# EAGLE board reg-board (EAGLE 7.6.0)
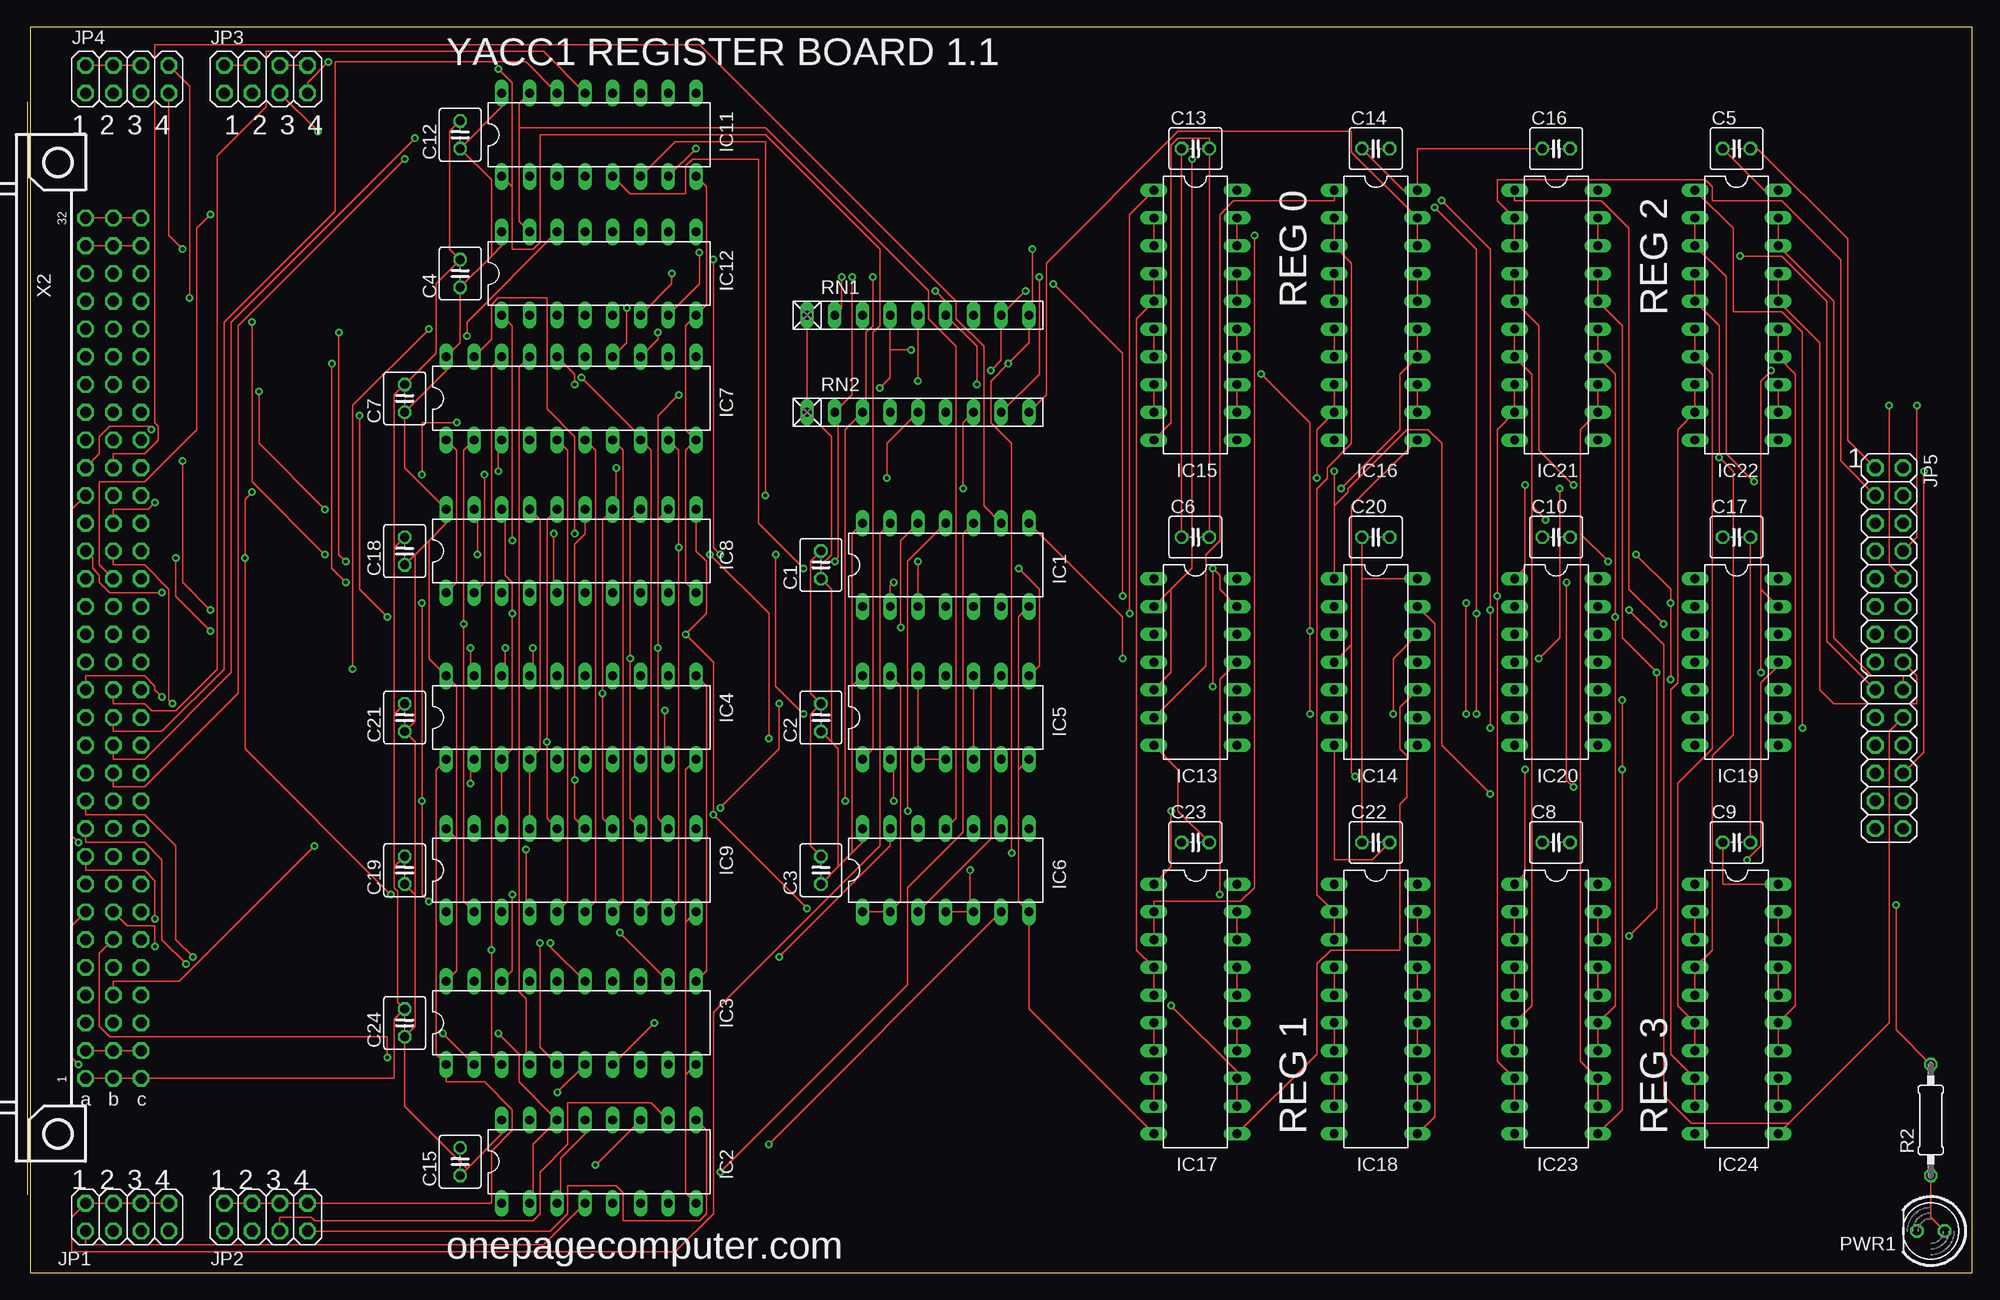
[diagram p3: board, top side]
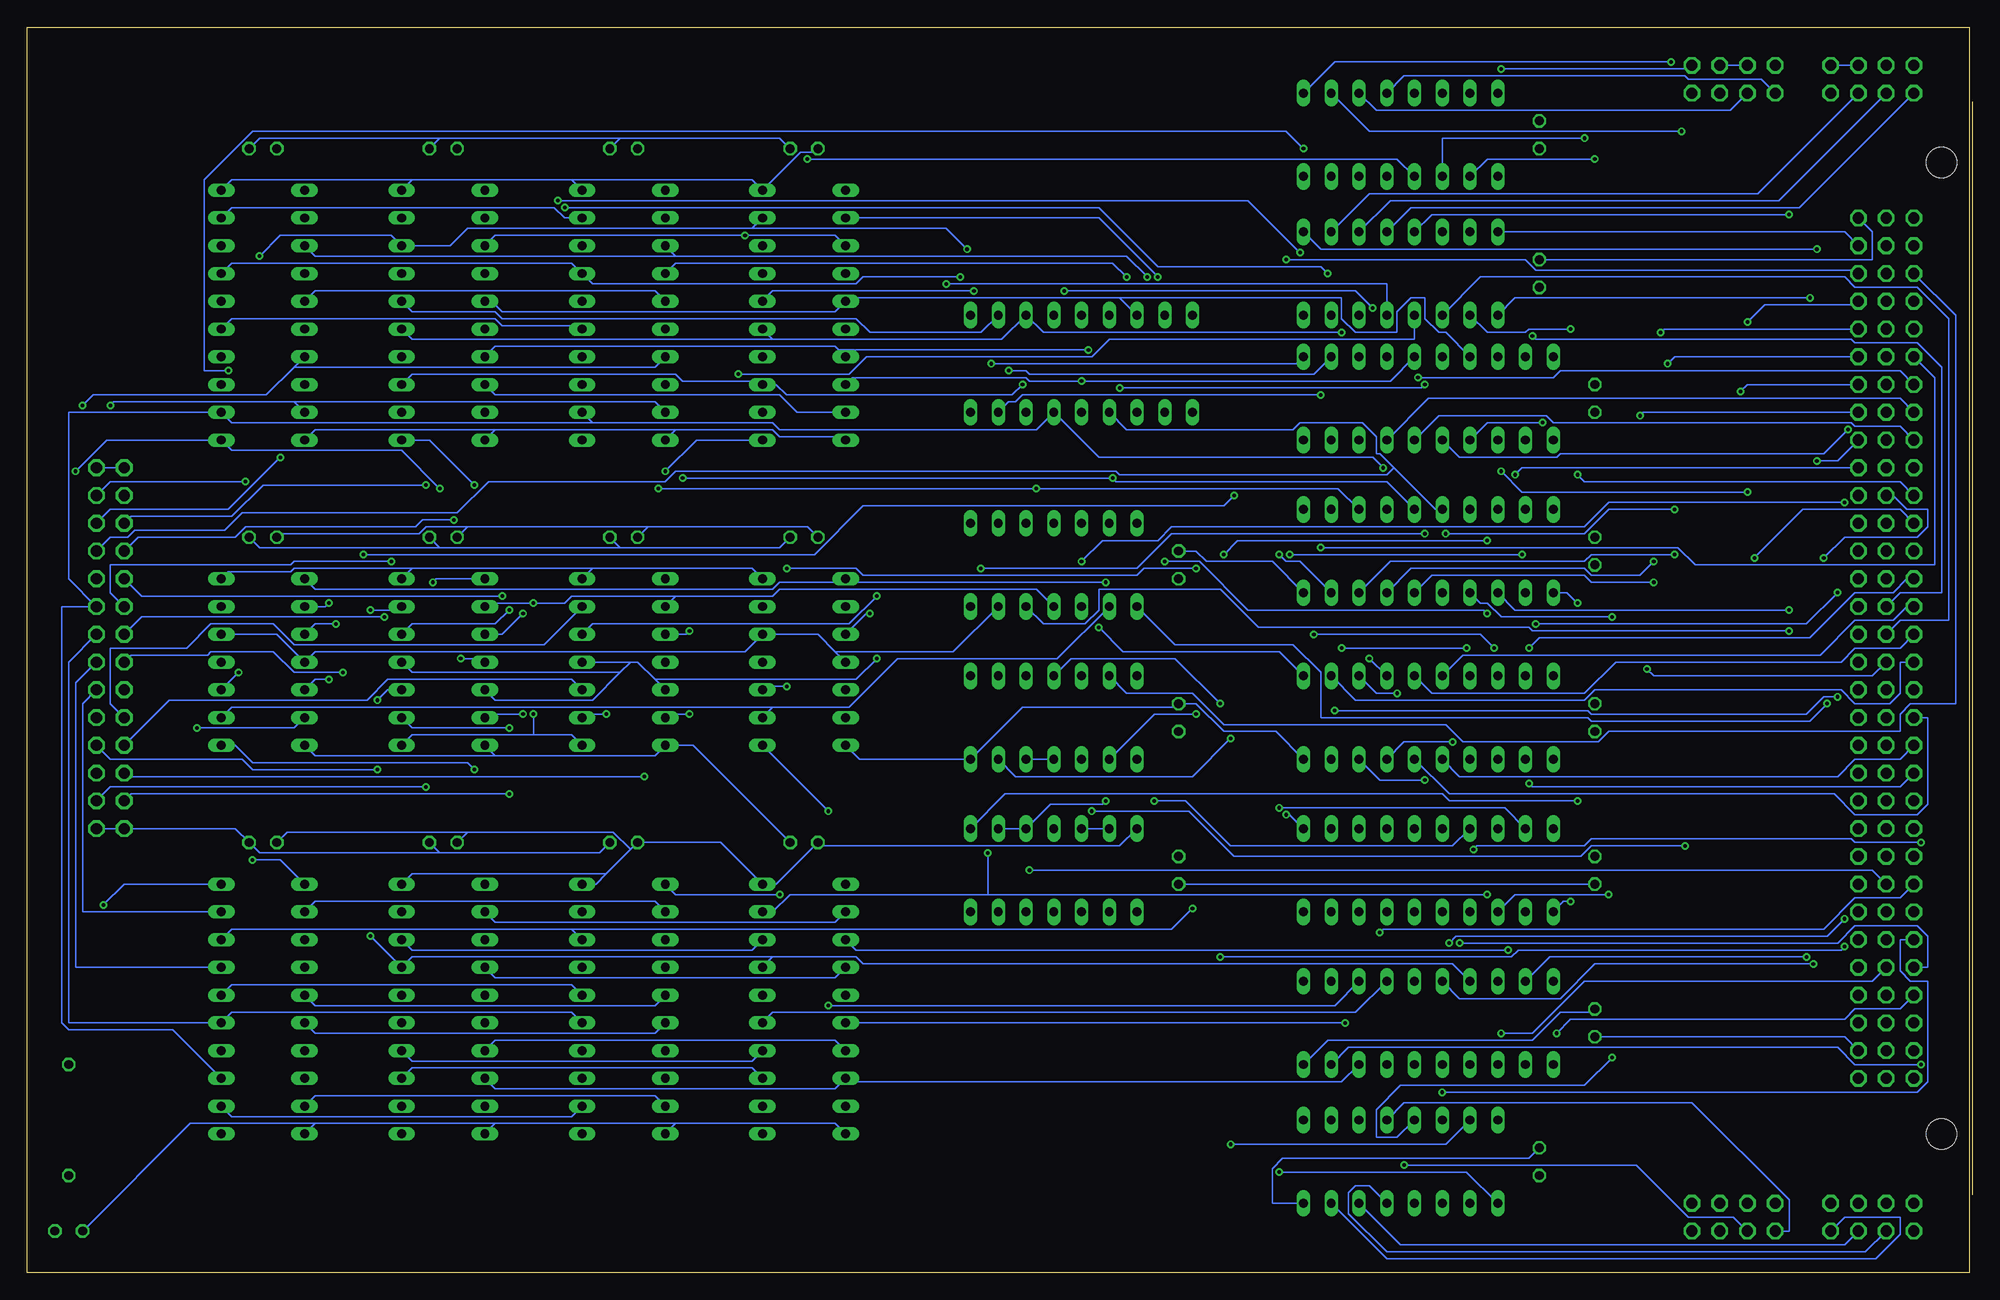
[diagram p4: board, bottom side, seen from below]

Size 177.78 x 113.97 mm. Coordinates in mm from the lower left corner, seen from the top.
Outline: 0,0 177.78,0 177.78,113.97 0,113.97 0,0
Copper layers (1*16): Top 0.0356mm / dielectric 1.5011mm / Bottom 0.0356mm
Design rules "LaenPCBOrder *": minimum track width 6mil, minimum drill 13mil, track to track 8mil, track to pad 8mil, pad to pad 8mil, via to via 8mil, smd to smd 6mil, copper to edge 20mil, drill to drill 6mil, minimum pad ring 7mil, minimum via ring 7mil, stop-mask expansion 3mil, vias tented up to drill 0mil, thermal gap 10mil
Net classes: 1 GND: width 1 mm; 2 5V: width 1 mm

## Footprints (pad centres in the part's own frame; a part is rotated, then mirrored left to right if it is on the bottom)
C025-040X050 = drill 0.813 octagon: 1 -1.27,0; 2 1.27,0
DIL14 = drill 0.813 long: 1 -7.62,-3.81; 2 -5.08,-3.81; 3 -2.54,-3.81; 4 0,-3.81; 5 2.54,-3.81; 6 5.08,-3.81; 7 7.62,-3.81; 8 7.62,3.81; 9 5.08,3.81; 10 2.54,3.81; 11 0,3.81; 12 -2.54,3.81; 13 -5.08,3.81; 14 -7.62,3.81
DIL16 = drill 0.813 long: 1 -8.89,-3.81; 2 -6.35,-3.81; 3 -3.81,-3.81; 4 -1.27,-3.81; 5 1.27,-3.81; 6 3.81,-3.81; 7 6.35,-3.81; 8 8.89,-3.81; 9 8.89,3.81; 10 6.35,3.81; 11 3.81,3.81; 12 1.27,3.81; 13 -1.27,3.81; 14 -3.81,3.81; 15 -6.35,3.81; 16 -8.89,3.81
DIL20 = drill 0.813 long: 1 -11.43,-3.81; 2 -8.89,-3.81; 3 -6.35,-3.81; 4 -3.81,-3.81; 5 -1.27,-3.81; 6 1.27,-3.81; 7 3.81,-3.81; 8 6.35,-3.81; 9 8.89,-3.81; 10 11.43,-3.81; 11 11.43,3.81; 12 8.89,3.81; 13 6.35,3.81; 14 3.81,3.81; 15 1.27,3.81; 16 -1.27,3.81; 17 -3.81,3.81; 18 -6.35,3.81; 19 -8.89,3.81; 20 -11.43,3.81
2X04 = drill 1.016 octagon: 1 -3.81,-1.27; 2 -3.81,1.27; 3 -1.27,-1.27; 4 -1.27,1.27; 5 1.27,-1.27; 6 1.27,1.27; 7 3.81,-1.27; 8 3.81,1.27
2X14 = drill 1.016 octagon: 1 -16.51,-1.27; 2 -16.51,1.27; 3 -13.97,-1.27; 4 -13.97,1.27; 5 -11.43,-1.27; 6 -11.43,1.27; 7 -8.89,-1.27; 8 -8.89,1.27; 9 -6.35,-1.27; 10 -6.35,1.27; 11 -3.81,-1.27; 12 -3.81,1.27; 13 -1.27,-1.27; 14 -1.27,1.27; 15 1.27,-1.27; 16 1.27,1.27; 17 3.81,-1.27; 18 3.81,1.27; 19 6.35,-1.27; 20 6.35,1.27; 21 8.89,-1.27; 22 8.89,1.27; 23 11.43,-1.27; 24 11.43,1.27; 25 13.97,-1.27; 26 13.97,1.27; 27 16.51,-1.27; 28 16.51,1.27
LED5MM = drill 0.813 octagon: A -1.27,0; K 1.27,0
0207/10 = drill 0.813 octagon: 1 -5.08,0; 2 5.08,0
RN-9 = drill 0.813 long: 1 -10.16,0; 2 -7.62,0; 3 -5.08,0; 4 -2.54,0; 5 0,0; 6 2.54,0; 7 5.08,0; 8 7.62,0; 9 10.16,0
FABC96R = drill 1.016 octagon: A1 -2.54,39.37; A2 -2.54,36.83; A3 -2.54,34.29; A4 -2.54,31.75; A5 -2.54,29.21; A6 -2.54,26.67; A7 -2.54,24.13; A8 -2.54,21.59; A9 -2.54,19.05; A10 -2.54,16.51; A11 -2.54,13.97; A12 -2.54,11.43; A13 -2.54,8.89; A14 -2.54,6.35; A15 -2.54,3.81; A16 -2.54,1.27; A17 -2.54,-1.27; A18 -2.54,-3.81; A19 -2.54,-6.35; A20 -2.54,-8.89; A21 -2.54,-11.43; A22 -2.54,-13.97; A23 -2.54,-16.51; A24 -2.54,-19.05; A25 -2.54,-21.59; A26 -2.54,-24.13; A27 -2.54,-26.67; A28 -2.54,-29.21; A29 -2.54,-31.75; A30 -2.54,-34.29; A31 -2.54,-36.83; A32 -2.54,-39.37; B1 -5.08,39.37; B2 -5.08,36.83; B3 -5.08,34.29; B4 -5.08,31.75; B5 -5.08,29.21; B6 -5.08,26.67; B7 -5.08,24.13; B8 -5.08,21.59; B9 -5.08,19.05; B10 -5.08,16.51; B11 -5.08,13.97; B12 -5.08,11.43; B13 -5.08,8.89; B14 -5.08,6.35; B15 -5.08,3.81; B16 -5.08,1.27; B17 -5.08,-1.27; B18 -5.08,-3.81; B19 -5.08,-6.35; B20 -5.08,-8.89; B21 -5.08,-11.43; B22 -5.08,-13.97; B23 -5.08,-16.51; B24 -5.08,-19.05; B25 -5.08,-21.59; B26 -5.08,-24.13; B27 -5.08,-26.67; B28 -5.08,-29.21; B29 -5.08,-31.75; B30 -5.08,-34.29; B31 -5.08,-36.83; B32 -5.08,-39.37; C1 -7.62,39.37; C2 -7.62,36.83; C3 -7.62,34.29; C4 -7.62,31.75; C5 -7.62,29.21; C6 -7.62,26.67; C7 -7.62,24.13; C8 -7.62,21.59; C9 -7.62,19.05; C10 -7.62,16.51; C11 -7.62,13.97; C12 -7.62,11.43; C13 -7.62,8.89; C14 -7.62,6.35; C15 -7.62,3.81; C16 -7.62,1.27; C17 -7.62,-1.27; C18 -7.62,-3.81; C19 -7.62,-6.35; C20 -7.62,-8.89; C21 -7.62,-11.43; C22 -7.62,-13.97; C23 -7.62,-16.51; C24 -7.62,-19.05; C25 -7.62,-21.59; C26 -7.62,-24.13; C27 -7.62,-26.67; C28 -7.62,-29.21; C29 -7.62,-31.75; C30 -7.62,-34.29; C31 -7.62,-36.83; C32 -7.62,-39.37 | hole 2.794: 0,-44.456; 0,44.456

## Placement (x,y rotation side)
C1  [C025-040X050]  72.39,64.77 90 top
C2  [C025-040X050]  72.39,50.8 90 top
C3  [C025-040X050]  72.39,36.83 90 top
C4  [C025-040X050]  39.37,91.44 90 top
C5  [C025-040X050]  156.21,102.87 0 top
C6  [C025-040X050]  106.68,67.31 0 top
C7  [C025-040X050]  34.29,80.01 90 top
C8  [C025-040X050]  139.7,39.37 0 top
C9  [C025-040X050]  156.21,39.37 0 top
C10  [C025-040X050]  139.7,67.31 0 top
C12  [C025-040X050]  39.37,104.14 90 top
C13  [C025-040X050]  106.68,102.87 0 top
C14  [C025-040X050]  123.19,102.87 0 top
C15  [C025-040X050]  39.37,10.16 90 top
C16  [C025-040X050]  139.7,102.87 0 top
C17  [C025-040X050]  156.21,67.31 0 top
C18  [C025-040X050]  34.29,66.04 90 top
C19  [C025-040X050]  34.29,36.83 90 top
C20  [C025-040X050]  123.19,67.31 0 top
C21  [C025-040X050]  34.29,50.8 90 top
C22  [C025-040X050]  123.19,39.37 0 top
C23  [C025-040X050]  106.68,39.37 0 top
C24  [C025-040X050]  34.29,22.86 90 top
IC1  74LS04N  [DIL14]  83.82,64.77 0 top
IC2  74LS139N  [DIL16]  52.07,10.16 0 top
IC3  74S374N  [DIL20]  49.53,22.86 0 top
IC4  74S374N  [DIL20]  49.53,50.8 0 top
IC5  74LS00N  [DIL14]  83.82,50.8 0 top
IC6  74LS00N  [DIL14]  83.82,36.83 0 top
IC7  74LS245N  [DIL20]  49.53,80.01 0 top
IC8  74LS245N  [DIL20]  49.53,66.04 0 top
IC9  74LS245N  [DIL20]  49.53,36.83 0 top
IC11  74LS139N  [DIL16]  52.07,104.14 0 top
IC12  74LS139N  [DIL16]  52.07,91.44 0 top
IC13  7432N  [DIL14]  106.68,55.88 270 top
IC14  74LS02N  [DIL14]  123.19,55.88 270 top
IC15  74S374N  [DIL20]  106.68,87.63 270 top
IC16  74S374N  [DIL20]  123.19,87.63 270 top
IC17  74S374N  [DIL20]  106.68,24.13 270 top
IC18  74S374N  [DIL20]  123.19,24.13 270 top
IC19  7432N  [DIL14]  156.21,55.88 270 top
IC20  74LS02N  [DIL14]  139.7,55.88 270 top
IC21  74S374N  [DIL20]  139.7,87.63 270 top
IC22  74S374N  [DIL20]  156.21,87.63 270 top
IC23  74S374N  [DIL20]  139.7,24.13 270 top
IC24  74S374N  [DIL20]  156.21,24.13 270 top
JP1  [2X04]  8.89,5.08 0 top
JP2  [2X04]  21.59,5.08 0 top
JP3  [2X04]  21.59,109.22 0 top
JP4  [2X04]  8.89,109.22 0 top
JP5  [2X14]  170.18,57.15 270 top
PWR1  [LED5MM]  173.99,3.81 180 top
R2  330  [0207/10]  173.99,13.97 90 top
RN1  [RN-9]  81.28,87.63 0 top
RN2  [RN-9]  81.28,78.74 0 top
X2  FABC96R  [FABC96R]  2.54,57.15 180 top

## Tracks (layer width: path | path; a pad name or v marks a point on that pad's centre or on a via)
-R0-RDSEL  (via drill 0.33)
  Top 0.152: v106.36,101.92 106.36,64.45 104.46,62.55 | IC13.2 104.46,62.55 | IC13.5 104.46,54.93 104.46,62.55
  Bottom 0.152: IC11.4 52.39,101.92 v106.36,101.92
-R0-WRSEL  (via drill 0.33)
  Top 0.152: v112.71,82.23 117.16,77.79 v117.16,58.74 v117.16,51.12
  Bottom 0.152: IC12.4 50.8,85.41 78.74,85.41 80.33,83.82 100.97,83.82 102.55,82.23 v112.71,82.23 | v117.16,58.74 117.47,58.42 IC14.3 | IC14.6 119.06,51.12 v117.16,51.12
-R1-RDSEL  (via drill 0.33)
  Top 0.152: IC11.5 54.93,98.74 60.01,98.74 60.01,101.28 60.64,101.92 66.67,101.92 66.67,68.58 v70.8,64.45 | IC13.13 108.9,62.55 108.9,63.82 v108.27,64.45 v108.27,53.66
  Bottom 0.152: v70.8,64.45 75.56,64.45 76.2,63.82 101.28,63.82 101.92,64.45 v108.27,64.45 | IC13.10 110.17,53.66 v108.27,53.66
-R1-WRSEL  (via drill 0.33)
  Top 0.152: v93.66,90.49 100.01,84.14 v100.01,61.91 | v124.78,51.12 124.78,56.2 IC14.12
  Bottom 0.152: IC12.5 53.34,90.49 v93.66,90.49 | v100.01,61.91 102.55,59.37 126.05,59.37 IC14.12 | IC14.9 126.68,51.12 v124.78,51.12
-R2-RDSEL  (via drill 0.33)
  Top 0.152: IC11.6 59.05,103.5 67.31,103.5 v67.31,71.12 | v147,65.72 150.18,62.55 v150.18,61.28 v150.18,54.29
  Bottom 0.152: v67.31,71.12 68.26,70.17 101.28,70.17 105.73,65.72 v147,65.72 | v150.18,61.28 150.5,60.96 IC19.2 | IC19.5 151.45,54.29 v150.18,54.29
-R2-WRSEL  (via drill 0.33)
  Top 0.152: IC12.6 58.74,90.49 v58.74,91.44 | v128.59,97.47 132.4,93.66 v132.4,60.33 v132.4,51.12
  Bottom 0.152: v58.74,91.44 59.37,92.08 74.3,92.08 79.69,97.47 v128.59,97.47 | v132.4,60.33 134.3,58.42 IC20.3 | IC20.6 135.57,51.12 v132.4,51.12
-R3-RDSEL  (via drill 0.33)
  Top 0.152: v60.96,102.87 IC11.7 | v159.38,82.55 158.43,81.6 158.43,62.55 | IC19.13 158.43,62.55 | 158.43,62.55 v158.43,54.93
  Bottom 0.152: v60.96,102.87 62.55,104.46 157.16,104.46 161.61,100.01 161.61,82.55 v159.38,82.55 | v158.43,54.93 IC19.10
-R3-WRSEL  (via drill 0.33)
  Top 0.152: IC12.7 61.28,90.49 v61.28,93.34 | v129.22,98.11 133.67,93.66 v133.67,60.64 v133.67,49.85
  Bottom 0.152: v61.28,93.34 66.04,98.11 v129.22,98.11 | v133.67,60.64 134.94,59.37 142.56,59.37 IC20.12 | IC20.9 142.56,49.85 v133.67,49.85
-RDSEL  (via drill 0.33)
  Top 0.152: JP3.4 JP3.2 | JP3.8 JP3.6 | IC5.1 77.15,47.94 77.15,86.04 77.79,86.68 77.79,93.66 67.31,104.14 46.67,104.14 46.67,94.3 46.04,93.66 44.13,93.66 44.13,99.38 | IC11.1 44.13,99.38 | v42.86,110.17 44.13,108.9 44.13,99.38
  Bottom 0.152: JP3.6 JP3.4 | JP3.8 25.72,110.17 v42.86,110.17
-RFUNC
  Top 0.152: IC12.15 44.77,96.2 44.77,104.78 | 44.77,104.78 44.77,107 IC11.15 | IC6.11 84.77,41.59 84.77,84.77 82.23,87.31 82.23,89.85 67.31,104.78 44.77,104.78
-RRDH
  Bottom 0.152: IC19.12 154.94,58.42 IC19.4 151.45,56.83 112.08,56.83 IC13.12 105.41,58.42 103.82,56.83 | 103.82,56.83 IC13.4 | IC1.6 93.03,56.83 103.82,56.83
-RRDL  (via drill 0.33)
  Top 0.152: v79.06,63.18 78.74,62.87 IC1.2
  Bottom 0.152: IC19.1 151.45,62.55 109.54,62.55 108.9,63.18 103.19,63.18 IC13.1 102.55,63.18 v79.06,63.18 | IC1.2 83.5,56.2 98.11,56.2 102.55,51.75 109.54,51.75 | IC13.9 109.54,51.75 | IC19.9 159.07,51.75 109.54,51.75
-RWRH  (via drill 0.33)
  Top 0.152: IC1.8 100.01,60.01 v100.01,56.2
  Bottom 0.152: 120.33,54.29 121.92,55.88 122.56,55.88 | 120.33,54.29 IC14.5 | IC14.11 122.56,55.88 | v100.01,56.2 101.92,54.29 120.33,54.29 | IC20.5 134.94,52.39 126.05,52.39 123.51,54.93 | 122.56,55.88 123.51,54.93 | IC20.11 142.56,54.93 123.51,54.93
-RWRL  (via drill 0.33)
  Top 0.152: v131.44,61.28 v131.44,51.12
  Bottom 0.152: IC14.8 127.95,49.21 131.44,49.21 | 131.44,49.21 142.56,49.21 IC20.8 | IC1.4 85.41,62.55 108.9,62.55 109.54,61.91 118.43,61.91 | IC14.2 118.43,61.91 | IC20.2 135.57,61.28 v131.44,61.28 128.59,61.28 127.95,61.91 118.43,61.91 | v131.44,51.12 131.44,49.21
-WRSEL  (via drill 0.33)
  Top 0.152: IC5.2 79.06,46.67 v79.06,43.18 | JP4.2 JP4.4 JP4.6 | v14.61,89.22 14.61,108.58 JP4.8 | v70.8,51.12 68.26,53.66 v68.26,65.72 | v44.13,66.99 44.13,86.68 IC12.1
  Bottom 0.152: IC6.9 IC6.10 84.14,42.86 79.38,42.86 v79.06,43.18 | IC12.1 41.59,89.22 v14.61,89.22 | JP4.8 JP4.6 | IC5.2 74.61,51.12 v70.8,51.12 | v68.26,65.72 66.99,66.99 v44.13,66.99
ADATA0  (via drill 0.33)
  Top 0.152: RN1.2 74.3,88.27 v74.3,91.12 | IC15.2 IC15.3 | IC21.3 IC21.2 134.3,98.11 134.3,100.01 153.35,100.01 153.99,99.38 153.99,98.11 160.34,98.11 165.74,92.71 165.74,74.3 JP5.3 | IC17.3 IC17.2 102.87,33.97 110.81,33.97 112.08,35.24 v112.08,94.93 | IC23.2 IC23.3 | IC3.3 42.23,20 v42.23,29.53 42.23,82.87 IC7.18
  Bottom 0.152: v74.3,91.12 79.69,96.52 IC15.2 | IC15.3 103.82,94.93 v112.08,94.93 134.94,94.93 IC21.3 | IC17.2 103.82,32.07 134.94,32.07 IC23.2 | IC17.3 101.92,29.53 v42.23,29.53
ADATA1  (via drill 0.33)
  Top 0.152: IC3.4 45.4,19.37 45.4,25.08 44.77,25.72 44.77,82.87 IC7.17 | IC17.5 IC17.4 101.28,29.53 101.28,87.31 IC15.5 IC15.4 | IC23.4 IC23.5 | IC21.4 IC21.5 138.11,86.68 138.11,75.25 v141.29,72.07
  Bottom 0.152: IC17.4 103.82,26.99 134.94,26.99 IC23.4 | 77.79,89.22 RN1.3 | 77.79,89.22 102.55,89.22 IC15.5 103.82,87.95 134.3,87.95 135.25,88.9 IC21.5 | JP5.5 168.28,69.22 159.07,69.22 156.21,72.07 v141.29,72.07 | IC7.17 47.94,86.04 48.58,86.04 49.85,87.31 49.85,89.22 51.12,89.22 52.39,87.95 52.39,86.04 56.2,86.04 57.47,87.31 57.47,89.22 77.79,89.22
ADATA2  (via drill 0.33)
  Top 0.152: IC23.7 IC23.6 137.48,24.45 137.48,70.17 | v57.15,22.86 IC3.7 | IC17.6 IC17.7 | IC7.16 49.85,82.23 v49.85,81.28 | v77.79,80.96 78.74,81.92 78.74,84.45 | RN1.4 78.74,84.45 | IC15.6 IC15.7 | IC21.6 IC21.7 137.48,82.23 137.48,70.17 | 137.48,70.17 v138.75,68.9 | v80.64,84.45 78.74,84.45
  Bottom 0.152: IC17.6 v57.15,22.86 | IC23.7 134.94,21.27 103.82,21.27 IC17.7 | v49.85,81.28 50.16,80.96 v77.79,80.96 | JP5.7 167.64,67.31 158.75,67.31 157.8,68.26 142.24,68.26 141.6,68.9 v138.75,68.9 | 103.5,84.45 103.82,84.77 134.94,84.77 IC21.7 | 103.5,84.45 IC15.7 | 103.5,84.45 v80.64,84.45
ADATA3  (via drill 0.33)
  Top 0.152: IC23.9 IC23.8 134.3,19.37 v134.3,61.91 134.3,77.15 IC21.9 IC21.8 | IC17.8 IC17.9 | IC15.8 IC15.9 | v81.28,81.6 RN1.5
  Bottom 0.152: IC3.8 57.47,17.46 102.55,17.46 IC17.8 103.82,16.83 134.94,16.83 IC23.8 | JP5.9 167.32,61.91 v134.3,61.91 | IC7.15 53.02,81.6 v81.28,81.6 86.04,81.6 86.36,81.92 102.23,81.92 IC15.8 | IC21.8 134.94,80.33 108.9,80.33 107.31,78.74 IC15.9
ADATA4  (via drill 0.33)
  Top 0.152: IC23.12 IC23.13 141.92,19.37 141.92,67.63 | IC17.12 IC17.13 110.49,18.41 v104.46,24.45 | IC7.14 54.61,85.09 v54.61,88.27 | v82.87,89.85 83.82,88.9 RN1.6 86.68,84.77 v86.68,81.28 | IC15.13 IC15.12 | IC21.13 IC21.12 141.92,77.15 141.92,67.63 | 141.92,67.63 v144.46,65.09
  Bottom 0.152: IC3.13 58.1,24.45 v104.46,24.45 | IC23.13 142.56,18.73 111.44,18.73 IC17.13 | v54.61,88.27 56.2,89.85 v82.87,89.85 | JP5.11 170.18,62.23 170.18,64.77 153.67,64.77 153.35,65.09 v144.46,65.09 | IC21.13 142.56,82.23 118.43,82.23 117.79,81.6 110.81,81.6 IC15.13 109.22,81.28 108.27,80.33 87.63,80.33 v86.68,81.28
ADATA5  (via drill 0.33)
  Top 0.152: IC23.14 IC23.15 145.1,24.45 v145.1,60.01 145.1,82.23 IC21.14 IC21.15 | IC17.15 IC17.14 | IC15.15 IC15.14 | IC7.13 57.47,85.41 v57.47,86.04
  Bottom 0.152: IC3.14 56.2,23.81 109.54,23.81 IC17.15 | IC23.14 142.56,19.37 111.44,19.37 IC17.14 | JP5.13 167.32,60.01 v145.1,60.01 | v57.47,86.04 84.77,86.04 RN1.7 88.58,85.41 109.54,85.41 | 109.54,85.41 IC15.15 | IC21.15 142.56,85.41 109.54,85.41
ADATA6  (via drill 0.33)
  Top 0.152: IC23.17 IC23.16 | IC17.17 IC17.16 | IC15.17 IC15.16 | v87.95,82.55 88.9,83.5 RN1.8 v91.12,89.85 | IC21.17 IC21.16 145.73,86.68 145.73,58.1 v148.91,54.93 148.91,33.34 v146.37,30.8
  Bottom 0.152: IC3.17 47.31,28.26 101.28,28.26 101.92,28.89 109.54,28.89 | IC17.17 109.54,28.89 | 109.54,28.89 142.56,28.89 IC23.17 v146.37,30.8 | IC7.12 60.01,82.23 86.04,82.23 86.36,82.55 v87.95,82.55 | IC15.16 109.54,89.85 v91.12,89.85 | JP5.15 168.28,56.52 161.29,56.52 160.97,56.83 155.26,56.83 153.35,54.93 v148.91,54.93 | RN1.8 90.49,86.04 100.65,86.04 101.92,87.31 134.3,87.31 134.94,87.95 142.56,87.95 IC21.16
ADATA7  (via drill 0.33)
  Top 0.152: IC23.19 IC23.18 | IC3.18 44.13,27.62 v44.13,34.61 | IC17.19 IC17.18 | IC15.19 IC15.18 | IC21.19 IC21.18 | JP5.17 164.47,57.78 164.47,88.9 160.34,93.03 v156.53,93.03 | v91.76,93.66 91.76,87.95 RN1.9 91.44,85.09 v89.53,83.19 87.95,81.6 87.95,77.79 89.85,75.88 v89.85,38.42
  Bottom 0.152: 89.85,34.61 107.95,34.61 109.54,33.02 IC17.19 | 89.85,34.61 v44.13,34.61 | IC23.18 142.56,29.53 111.44,29.53 IC17.18 | IC7.11 61.59,83.19 v89.53,83.19 | v156.53,93.03 154.62,94.93 144.46,94.93 IC21.18 139.06,93.98 137.48,95.57 111.44,95.57 | 111.44,95.57 IC15.19 | v91.76,93.66 93.66,95.57 111.44,95.57 | v89.85,38.42 89.85,34.61
ADATA8  (via drill 0.33)
  Top 0.152: IC22.2 IC22.3 155.26,91.12 155.26,74.93 v157.8,72.39 | IC18.3 IC18.2 117.79,34.61 117.79,71.75 118.75,72.71 118.75,73.66 120.97,75.88 120.97,92.39 IC16.3 IC16.2 | IC24.2 IC24.3 | IC9.18 IC4.3 44.13,47.94 v44.13,60.33 44.13,63.18 43.5,63.82 43.5,69.53 IC8.18 | 73.98,79.06 75.25,80.33 v75.25,91.12 | v73.66,65.09 73.98,65.41 73.98,79.06 | 73.98,79.06 RN2.2
  Bottom 0.152: JP5.4 170.18,72.39 v157.8,72.39 | IC18.2 120.33,33.97 151.45,33.97 IC24.2 | v75.25,91.12 77.15,93.03 118.43,93.03 | IC16.3 118.43,93.03 | v44.13,60.33 44.45,60.64 66.04,60.64 70.48,65.09 v73.66,65.09 | IC22.3 151.45,93.03 118.43,93.03
ADATA9  (via drill 0.33)
  Top 0.152: IC18.4 IC18.5 | IC24.5 IC24.4 153.99,29.53 153.99,47.31 155.89,49.21 155.89,73.34 v154.62,74.61 154.62,86.68 IC22.5 IC22.4 | IC9.17 IC4.4 46.67,47.94 46.67,68.9 IC8.17 | v77.15,91.12 77.15,86.68 76.52,86.04 76.52,79.06 RN2.3 74.61,77.15 v74.61,43.18 | IC16.4 IC16.5
  Bottom 0.152: IC18.5 120.33,24.45 151.45,24.45 IC24.5 | JP5.6 170.18,69.85 159.38,69.85 v154.62,74.61 | v77.15,91.12 78.42,92.39 118.43,92.39 IC16.4 | IC9.17 47.31,39.05 67.63,39.05 71.75,43.18 v74.61,43.18 | IC22.5 151.45,89.85 120.33,89.85 IC16.5
ADATA10  (via drill 0.33)
  Top 0.152: IC9.16 47.31,41.59 v47.31,48.58 47.31,68.9 IC8.16 | IC18.6 IC18.7 | IC24.7 IC24.6 150.81,24.45 150.81,44.77 153.99,47.94 153.99,82.23 IC22.7 IC22.6 | IC16.6 IC16.7 | JP5.8 172.72,67.31 v172.72,79.38
  Bottom 0.152: IC4.7 51.75,48.58 v47.31,48.58 | RN2.4 77.15,77.15 61.91,77.15 61.28,77.79 55.56,77.79 54.29,76.52 54.29,74.93 53.98,74.93 52.7,73.66 | 52.7,73.66 48.9,69.85 IC8.16 | IC18.6 120.33,21.91 151.45,21.91 IC24.6 | v172.72,79.38 171.77,80.33 155.89,80.33 153.35,82.87 | IC22.7 153.35,82.87 | IC16.7 120.33,82.87 153.35,82.87 | 52.7,73.66 53.34,73.03 77.79,73.03 78.11,73.34 118.43,73.34 119.38,72.39 135.57,72.39 138.43,69.53 158.12,69.53 159.7,67.94 167.96,67.94 168.59,67.31 170.18,67.31 JP5.8
ADATA11  (via drill 0.33)
  Top 0.152: IC9.15 49.85,41.59 v49.85,45.09 49.85,66.67 50.8,67.63 IC8.15 | RN2.5 78.42,75.88 v78.42,72.71 | IC18.8 IC18.9 | IC24.9 IC24.8 150.18,20 150.18,53.34 150.81,53.98 150.81,77.15 IC22.9 IC22.8 | IC16.8 IC16.9 117.79,77.15 v117.79,72.71 | JP5.10 170.18,64.77 v170.18,79.38
  Bottom 0.152: IC4.8 53.98,45.09 v49.85,45.09 | IC8.15 53.34,72.39 78.11,72.39 v78.42,72.71 v117.79,72.71 | IC18.9 120.33,16.19 151.45,16.19 IC24.9 | v170.18,79.38 169.86,79.69 153.35,79.69 | IC22.9 153.35,79.69 | IC16.9 120.33,79.69 153.35,79.69
ADATA12  (via drill 0.33)
  Top 0.152: IC18.13 IC18.12 | IC24.13 IC24.12 | IC22.13 IC22.12 | IC9.14 52.39,41.59 v52.39,53.02 52.39,68.9 IC8.14 53.66,70.17 v53.66,73.66 | IC16.12 IC16.13
  Bottom 0.152: IC18.12 127.95,14.29 159.07,14.29 IC24.12 | IC4.13 54.29,53.02 v52.39,53.02 | 126.05,77.79 109.54,77.79 108.9,77.15 85.41,77.15 RN2.6 79.69,74.61 54.61,74.61 v53.66,73.66 | IC16.12 126.05,77.79 | 126.05,77.79 159.07,77.79 IC22.12 173.99,78.74 173.99,63.5 JP5.12 174.62,60.96 174.62,22.86 173.99,22.23 164.47,22.23 IC24.13
ADATA13  (via drill 0.33)
  Top 0.152: IC9.13 54.93,41.59 v54.93,56.2 54.93,68.9 IC8.13 | RN2.7 85.41,77.79 v85.41,71.75 | IC16.15 IC16.14 125.41,82.23 125.41,77.15 v120.02,71.75 | IC22.15 IC22.14 161.61,82.23 161.61,24.45 IC24.15 IC24.14 | IC18.15 IC18.14
  Bottom 0.152: v54.93,56.2 IC4.14 | IC8.13 57.78,71.75 v85.41,71.75 v120.02,71.75 | IC16.15 127.32,86.68 134.3,86.68 134.94,87.31 159.07,87.31 IC22.15 | JP5.14 173.99,55.88 173.99,22.86 IC24.15 159.07,23.81 127.95,23.81 IC18.15
ADATA14  (via drill 0.33)
  Top 0.152: IC9.12 57.47,41.59 v57.47,57.15 57.47,68.9 | IC8.12 57.47,68.9 | IC4.17 46.04,54.93 v46.04,57.15 | v59.37,80.33 57.47,78.42 57.47,68.9 | IC16.17 IC16.16 | IC22.17 IC22.16 163.83,85.09 163.83,53.34 165.1,52.07 172.72,52.07 172.72,54.61 JP5.16 | IC18.17 IC18.16 | IC24.17 IC24.16 | RN2.8 92.39,82.23 v92.39,91.12
  Bottom 0.152: v57.47,57.15 v46.04,57.15 | RN2.8 87.95,79.69 87.31,79.69 86.68,80.33 v59.37,80.33 | IC22.17 159.07,92.39 127.95,92.39 IC16.17 126.05,90.49 101.92,90.49 101.28,91.12 v92.39,91.12 | JP5.16 173.35,53.98 173.35,27.94 IC24.17 | IC18.16 127.95,26.35 159.07,26.35 IC24.16
ADATA15  (via drill 0.33)
  Top 0.152: IC22.19 IC22.18 165.1,88.9 165.1,58.1 168.59,54.61 171.45,54.61 JP5.18 | RN2.9 93.03,80.33 93.03,92.39 105.09,104.46 120.97,104.46 120.97,102.55 IC16.19 IC16.18 | IC4.18 43.5,54.93 v43.5,57.15 | IC8.11 60.96,66.04 61.91,65.09 61.91,60.33 v60.01,58.42 62.55,55.88 v62.55,41.91 v71.12,33.34 | IC18.19 IC18.18 | IC24.19 IC24.18
  Bottom 0.152: IC22.19 159.07,97.47 129.54,97.47 128.59,96.52 IC16.19 | v43.5,57.15 44.77,58.42 v60.01,58.42 | IC9.11 62.23,41.91 v62.55,41.91 | JP5.18 172.72,52.07 172.72,33.02 IC24.19 | 127.95,31.43 IC18.18 | 127.95,31.43 159.07,31.43 IC24.18 | v71.12,33.34 73.03,31.43 127.95,31.43
ADDR0  (via drill 0.33)
  Top 0.152: v37.78,21.91 IC3.2
  Bottom 0.152: v37.78,21.91 36.51,23.18 11.43,23.18 10.48,24.13 6.35,24.13 X2.A4
ADDR1  (via drill 0.33)
  Top 0.152: IC3.5 46.67,20.64 v46.67,30.16
  Bottom 0.152: v46.67,30.16 12.06,30.16 10.48,31.75 4.76,31.75 3.81,30.8 3.81,27.94 X2.A5
ADDR2  (via drill 0.33)
  Top 0.152: v48.26,16.51 IC3.6
  Bottom 0.152: v48.26,16.51 4.76,16.51 3.81,17.46 3.81,26.67 5.4,26.67 6.35,27.62 6.35,30.48 X2.A6
ADDR3  (via drill 0.33)
  Top 0.152: v4.45,19.05 3.81,19.68 3.81,31.75 X2.A7
  Bottom 0.152: IC3.9 56.83,20.64 12.06,20.64 10.48,19.05 v4.45,19.05
ADDR4  (via drill 0.33)
  Top 0.152: v53.98,31.11 IC3.12
  Bottom 0.152: v53.98,31.11 53.66,31.43 13.34,31.43 10.48,34.29 6.35,34.29 X2.A8
ADDR5  (via drill 0.33)
  Top 0.152: IC3.15 47.62,29.84 v47.62,30.16 | v11.43,32.38 11.43,35.88 10.48,36.83 5.08,36.83 X2.A9
  Bottom 0.152: v47.62,30.16 46.99,30.8 13.02,30.8 v11.43,32.38
ADDR6  (via drill 0.33)
  Top 0.152: v14.29,28.26 12.06,30.48 12.06,37.78 10.48,39.37 5.08,39.37 X2.A10
  Bottom 0.152: IC3.16 46.67,25.08 37.47,25.08 34.29,28.26 v14.29,28.26
ADDR7  (via drill 0.33)
  Top 0.152: v14.92,28.89 13.34,30.48 13.34,39.05 10.48,41.91 5.08,41.91 X2.A11
  Bottom 0.152: IC3.19 38.42,28.89 v14.92,28.89
ADDR8  (via drill 0.33)
  Top 0.152: IC4.2 40.32,46.67 v40.32,44.77
  Bottom 0.152: v40.32,44.77 40.01,44.45 6.35,44.45 X2.A12
ADDR9
  Bottom 0.152: IC4.5 46.67,45.4 12.06,45.4 10.48,46.99 6.35,46.99 X2.A13
ADDR10
  Bottom 0.152: IC4.6 47.62,43.81 12.38,43.81 10.48,41.91 4.76,41.91 3.81,42.86 3.81,50.8 X2.A14
ADDR11  (via drill 0.33)
  Top 0.152: IC4.9 58.1,47.31 v58.1,51.44 | v12.06,52.7 11.43,53.34 11.43,53.66 10.48,54.61 5.08,54.61 X2.A15
  Bottom 0.152: v58.1,51.44 34.92,51.44 34.61,51.12 14.92,51.12 13.34,52.7 v12.06,52.7
ADDR12
  Bottom 0.152: IC4.12 56.2,52.39 35.24,52.39 34.29,53.34 11.75,53.34 10.48,52.07 7.3,52.07 6.35,53.02 6.35,55.88 X2.A16
ADDR13
  Bottom 0.152: IC4.15 49.21,53.02 35.24,53.02 32.38,55.88 11.75,55.88 10.48,57.15 6.35,57.15 X2.A17
ADDR14
  Bottom 0.152: IC4.16 46.35,56.52 13.65,56.52 10.48,59.69 6.99,59.69 5.71,60.96 X2.A18
ADDR15  (via drill 0.33)
  Top 0.152: IC4.19 40.32,54.93 v40.32,57.15
  Bottom 0.152: v40.32,57.15 39.37,58.1 14.61,58.1 10.48,62.23 6.99,62.23 5.71,63.5 X2.A19
ADDR-REG-CLK  (via drill 0.33)
  Top 0.152: IC1.11 80.33,65.09 v80.33,42.23 | v26.04,39.05 13.65,26.67 7.62,26.67 X2.B4
  Bottom 0.152: v80.33,42.23 71.44,42.23 67.31,38.1 35.56,38.1 34.61,39.05 v26.04,39.05
ADDR-REG-OUT  (via drill 0.33)
  Top 0.152: 86.04,33.02 IC6.4 | 86.04,33.02 v86.04,36.83 | 86.04,33.02 IC6.5
  Bottom 0.152: X2.B8 8.89,36.83 v86.04,36.83
BRD-ADDR-REG0  (via drill 0.33)
  Top 0.152: IC2.2 46.04,6.67 46.04,11.75 IC2.14 44.77,17.46 44.77,20 v42.86,21.91
  Bottom 0.152: X2.B5 8.89,26.67 35.24,26.67 40.01,21.91 v42.86,21.91
BRD-ADDR-REG1  (via drill 0.33)
  Top 0.152: IC2.3 48.58,6.67 48.58,10.48 50.8,12.7 IC2.13 | X2.B6 6.35,29.21 6.35,22.54 7.3,21.59 32.7,21.59 v32.7,19.68
  Bottom 0.152: v32.7,19.68 35.24,17.14 52.07,17.14 54.29,14.92 54.29,12.38 52.39,12.38 IC2.13
BRD-IN-ID0  (via drill 0.33)
  Top 0.152: IC12.14 40.01,87 v40.01,85.72
  Bottom 0.152: v40.01,85.72 39.69,85.41 10.79,85.41 10.48,85.09 4.76,85.09 2.54,82.87 2.54,62.23 6.35,62.23 X2.B18
BRD-IN-ID1  (via drill 0.33)
  Top 0.152: v16.51,96.84 15.24,95.57 15.24,77.15 10.48,72.39 6.35,72.39 6.35,64.77 X2.B19
  Bottom 0.152: IC12.13 49.21,96.84 v16.51,96.84
BRD-OUT-ID0
  Top 0.152: IC11.14 45.4,110.81 27.94,110.81 27.94,97.16 17.78,87 17.78,55.24 12.06,49.53 7.62,49.53 X2.B14
BRD-OUT-ID1
  Top 0.152: IC11.13 46.99,111.76 21.59,111.76 21.59,106.68 17.14,102.23 17.14,55.24 13.34,51.44 11.11,51.44 10.48,52.07 7.62,52.07 X2.B15
BUS-DIR  (via drill 0.33)
  Top 0.152: v36.51,33.97 35.88,34.61 v35.88,43.18 v35.88,61.28 | IC7.1 39.05,75.25 39.05,63.18 IC8.1
  Bottom 0.152: IC9.1 37.15,33.97 v36.51,33.97 | v35.88,61.28 36.83,62.23 IC8.1 | IC6.8 88.27,43.81 48.26,43.81 47.62,43.18 v35.88,43.18
CLK0H  (via drill 0.33)
  Top 0.152: 120.97,57.47 IC14.4 | 120.97,57.47 120.97,70.17 IC16.11 | v121.28,45.4 120.97,45.72 120.97,57.47
  Bottom 0.152: JP5.23 168.59,45.4 v121.28,45.4
CLK0L  (via drill 0.33)
  Top 0.152: v119.38,73.34 119.38,70.17 | 119.38,70.17 IC14.1 | v133.67,43.81 129.22,48.26 129.22,75.88 127.95,77.15 126.05,77.15 120.65,71.75 120.65,71.44 119.38,70.17
  Bottom 0.152: v119.38,73.34 116.52,76.2 IC15.11 | JP5.25 168.28,43.81 v133.67,43.81
CLK1H
  Top 0.152: IC18.11 128.59,14.29 128.59,59.37 IC14.13
  Bottom 0.152: JP5.19 170.18,52.07 170.18,57.15 163.19,57.15 160.97,59.37 155.26,59.37 153.35,57.47 130.49,57.47 IC14.13
CLK1L
  Top 0.152: IC17.11 117.79,20 117.79,28.26 119.06,29.53 125.41,29.53 125.41,42.86 126.05,43.5 126.05,47.31 125.41,47.94 125.41,51.75 IC14.10
  Bottom 0.152: JP5.21 164.78,52.39 146.69,52.39 144.78,54.29 127.95,54.29 IC14.10
CLK2H  (via drill 0.33)
  Top 0.152: v138.11,56.2 140.02,58.1 v140.02,71.75 | JP5.24 173.35,47.62 v173.35,73.34
  Bottom 0.152: IC20.4 136.21,56.2 v138.11,56.2 | v140.02,71.75 143.51,75.25 159.07,75.25 IC22.11 170.5,76.2 v173.35,73.34
CLK2L  (via drill 0.33)
  Top 0.152: IC20.1 136.84,64.45 v136.84,72.07 | v141.29,44.45 140.65,45.09 v140.65,63.18
  Bottom 0.152: v136.84,72.07 140.97,76.2 IC21.11 | JP5.26 170.18,44.45 v141.29,44.45 | v140.65,63.18 140.34,63.5 IC20.1
CLK3H  (via drill 0.33)
  Top 0.152: 160.97,13.65 170.18,22.86 170.18,49.53 JP5.20 | 160.97,13.65 IC24.11 | v146.37,60.64 149.54,57.47 149.54,16.19 152.08,13.65 160.97,13.65
  Bottom 0.152: IC20.13 143.83,60.64 v146.37,60.64
CLK3L  (via drill 0.33)
  Top 0.152: IC23.11 145.73,14.92 v145.73,46.04 v145.73,52.39
  Bottom 0.152: v145.73,52.39 144.78,53.34 IC20.10 | JP5.22 170.18,46.99 158.12,46.99 157.16,46.04 v145.73,46.04
DATA0  (via drill 0.33)
  Top 0.152: IC9.2 39.69,33.97 v39.69,59.37 39.69,75.25 IC7.2 | X2.A20 5.71,65.41 5.71,64.45 6.35,63.82 6.35,63.18 7.3,62.23 v12.06,62.23
  Bottom 0.152: v12.06,62.23 14.92,59.37 v39.69,59.37
DATA1  (via drill 0.33)
  Top 0.152: v33.02,34.61 19.68,47.94 v19.68,65.41 19.68,70.8 v20.32,71.44 | IC7.3 42.86,75.88 v42.86,73.34
  Bottom 0.152: IC9.3 41.59,34.61 v33.02,34.61 | v19.68,65.41 15.24,69.85 6.35,69.85 X2.A21 | v42.86,73.34 40.96,71.44 v20.32,71.44
DATA2  (via drill 0.33)
  Top 0.152: IC9.4 45.4,33.34 v45.4,38.73 | v4.45,39.37 3.81,40.01 3.81,69.85 X2.A22 | v39.05,77.79 35.88,77.79 v35.88,73.03
  Bottom 0.152: v45.4,38.73 45.09,39.05 35.24,39.05 34.61,39.69 10.79,39.69 10.48,39.37 v4.45,39.37 | IC7.4 44.13,77.79 v39.05,77.79 | v35.88,73.03 35.24,72.39 6.35,72.39 X2.A22
DATA3  (via drill 0.33)
  Top 0.152: IC9.5 49.21,33.97 49.21,75.25 IC7.5 | X2.A23 6.35,74.93 6.35,76.52 7.3,77.47 11.11,77.47 v11.11,77.15
  Bottom 0.152: v11.11,77.15 13.34,74.93 37.47,74.93 37.78,74.61 46.67,74.61 IC7.5
DATA4
  Top 0.152: IC9.6 51.75,33.97 51.75,75.25 IC7.6
  Bottom 0.152: X2.A24 6.35,77.47 10.48,77.47 10.79,77.79 38.1,77.79 38.73,78.42 48.58,78.42 IC7.6
DATA5
  Top 0.152: IC9.7 54.29,33.97 54.29,75.25 IC7.7
  Bottom 0.152: X2.A25 6.35,80.01 49.53,80.01 IC7.7
DATA6  (via drill 0.33)
  Top 0.152: IC9.8 56.83,33.97 56.83,75.25 IC7.8 55.88,76.52 v50.48,81.92
  Bottom 0.152: X2.A26 6.35,82.55 37.47,82.55 38.1,81.92 v50.48,81.92
DATA7  (via drill 0.33)
  Top 0.152: IC9.9 59.37,33.97 v59.37,66.36 59.37,75.25 IC7.9
  Bottom 0.152: X2.A27 3.17,81.92 3.17,64.77 25.08,64.77 26.67,66.36 v59.37,66.36
DATA8  (via drill 0.33)
  Top 0.152: IC8.2 41.59,63.18 v41.59,73.03
  Bottom 0.152: v41.59,73.03 40.96,73.66 X2.C23
DATA9  (via drill 0.33)
  Top 0.152: v16.51,60.64 13.97,63.18 v13.97,74.3
  Bottom 0.152: IC8.3 41.59,60.64 v16.51,60.64 | v13.97,74.3 12.06,74.3 X2.C24
DATA10  (via drill 0.33)
  Top 0.152: v32.7,60.01 30.16,62.55 v30.16,78.42
  Bottom 0.152: IC8.4 44.77,61.28 44.13,61.28 42.86,60.01 v32.7,60.01 | v30.16,78.42 29.84,78.74 X2.C25
DATA11  (via drill 0.33)
  Top 0.152: IC8.5 47.94,62.55 v47.94,67.63 | v26.99,69.85 20.95,75.88 v20.95,80.64
  Bottom 0.152: v47.94,67.63 35.24,67.63 33.02,69.85 v26.99,69.85 | v20.95,80.64 20.32,81.28 X2.C26
DATA12  (via drill 0.33)
  Top 0.152: v28.89,63.18 27.62,64.45 v27.62,83.19
  Bottom 0.152: IC8.6 49.21,63.82 35.24,63.82 34.61,63.18 v28.89,63.18 | v27.62,83.19 26.99,83.82 X2.C27
DATA13  (via drill 0.33)
  Top 0.152: v28.89,65.09 28.26,65.72 v28.26,86.04
  Bottom 0.152: IC8.7 51.12,64.45 35.24,64.45 34.61,63.82 30.16,63.82 v28.89,65.09 | v28.26,86.04 27.94,86.36 X2.C28
DATA14  (via drill 0.33)
  Top 0.152: v26.99,65.72 20.32,72.39 v20.32,87
  Bottom 0.152: IC8.8 53.02,65.09 35.24,65.09 34.61,65.72 v26.99,65.72 | v20.32,87 18.73,88.58 10.48,88.58 X2.C29
DATA15  (via drill 0.33)
  Top 0.152: v63.18,65.72 62.55,66.36 v62.55,92.71
  Bottom 0.152: IC8.9 61.28,65.09 62.55,65.09 v63.18,65.72 | v62.55,92.71 40.64,92.71 39.69,91.76 10.48,91.76 X2.C30
DATA-REG-IN-ID0  (via drill 0.33)
  Top 0.152: v36.51,86.36 29.53,79.38 v29.53,55.24
  Bottom 0.152: IC12.2 44.13,86.04 40.64,86.04 40.32,86.36 v36.51,86.36 | v29.53,55.24 28.89,54.61 8.89,54.61 X2.B16
DATA-REG-IN-ID1
  Bottom 0.152: IC12.3 44.77,91.12 11.43,91.12 10.48,90.17 4.76,90.17 1.91,87.31 1.91,59.69 6.35,59.69 X2.B17
DATA-REG-OUT-ID0  (via drill 0.33)
  Top 0.152: v34.29,101.92 19.05,86.68 19.05,53.02 10.48,44.45 7.62,44.45 X2.B12
  Bottom 0.152: IC11.2 44.13,101.92 v34.29,101.92
DATA-REG-OUT-ID1  (via drill 0.33)
  Top 0.152: v35.24,103.82 18.41,87 18.41,54.93 10.48,46.99 7.62,46.99 X2.B13
  Bottom 0.152: IC11.3 48.26,103.82 v35.24,103.82
DATA-REG-RD-HI  (via drill 0.33)
  Top 0.152: v16.51,58.74 13.34,61.91 v13.34,65.41
  Bottom 0.152: IC1.5 84.77,59.37 80.96,59.37 79.69,60.64 79.69,62.55 68.58,62.55 65.09,59.05 40.32,59.05 40.01,58.74 v16.51,58.74 | v13.34,65.41 11.43,67.31 4.76,67.31 3.81,68.26 3.81,69.85 5.71,69.85 6.99,71.12 X2.B22
DATA-REG-RD-LO  (via drill 0.33)
  Top 0.152: v13.02,52.07 12.7,52.39 12.7,62.55 10.48,64.77 7.62,64.77 X2.B20
  Bottom 0.152: IC1.1 72.71,57.47 61.91,57.47 59.37,54.93 59.37,50.8 34.92,50.8 34.61,50.48 14.61,50.48 v13.02,52.07
DATA-REG-WR-HI
  Top 0.152: IC1.9 87.31,70.17 87.31,84.77 84.77,87.31 84.77,88.9 61.28,112.39 11.43,112.39 11.43,77.79 11.75,77.47 11.75,76.2 10.48,74.93 7.62,74.93 X2.B23
DATA-REG-WR-LO  (via drill 0.33)
  Top 0.152: v81.28,65.09 IC1.3 | v11.43,70.48 10.79,69.85 7.62,69.85 X2.B21
  Bottom 0.152: v81.28,65.09 79.38,66.99 74.3,66.99 73.03,68.26 35.24,68.26 33.02,70.48 v11.43,70.48
GND
  Top 0.152: X2.A32 X2.B32 X2.C32 | C12.2 38.42,104.46 38.42,93.66 C4.2 37.15,90.49 37.15,84.14 C7.2 33.34,80.33 33.34,66.36 | X2.A1 X2.B1 X2.C1 33.34,17.78 33.34,23.18 C24.2 33.66,24.77 33.66,34.92 33.34,35.24 33.34,37.15 | C19.2 33.34,37.15 | 33.34,51.12 C21.2 | 33.34,37.15 33.34,51.12 | 33.34,66.36 C18.2 | 33.34,51.12 33.34,66.36 | IC2.8 60.01,7.3 60.01,18.1 | IC3.10 60.01,18.1 | 60.01,32.07 IC9.10 | 60.01,18.1 60.01,32.07 | IC4.10 60.01,46.04 60.01,32.07 | IC11.8 61.91,99.38 61.91,88.58 IC12.8 60.01,86.68 60.01,77.15 IC7.10 60.01,75.25 60.01,63.18 IC8.10 | C3.2 71.44,39.05 71.44,51.12 C2.2 71.44,53.02 71.44,65.09 C1.2 | JP5.1 166.37,76.2 166.37,94.61 158.12,102.87 C5.2 | IC15.10 104.46,77.79 104.46,103.19 105.09,103.82 107.95,103.82 C13.2 C6.2 | C23.2 105.09,42.23 105.09,46.04 IC13.7 | 90.49,46.04 90.49,33.97 IC6.7 91.44,24.13 IC17.10 | IC5.7 90.49,46.04 | IC1.7 90.49,60.01 90.49,46.04 | C22.2 122.87,37.78 119.38,37.78 IC14.7 | C9.2 C17.2
  Bottom 0.152: X2.C32 8.89,95.25 8.89,92.71 C4.2 | C15.2 40.32,10.48 62.87,10.48 63.82,9.53 63.82,6.35 IC2.8 | IC8.10 63.82,65.09 69.85,65.09 70.8,66.04 C1.2 | IC4.10 63.5,49.53 68.26,49.53 70.8,52.07 C2.2 72.71,51.75 86.68,51.75 IC5.7 101.6,46.99 IC13.7 | C24.2 34.61,23.81 37.47,23.81 40.01,21.27 58.74,21.27 IC3.10 | IC15.10 103.19,76.52 108.9,76.52 109.54,77.15 118.43,77.15 | IC16.10 118.43,77.15 | 134.94,77.15 IC21.10 | 118.43,77.15 134.94,77.15 | IC22.10 151.45,77.15 134.94,77.15 | JP5.2 JP5.1 | C13.2 108.9,103.82 123.51,103.82 | C14.2 123.51,103.82 | 140.02,103.82 C16.2 | 123.51,103.82 140.02,103.82 | C5.2 156.53,103.82 140.02,103.82 | IC17.10 103.82,13.65 118.43,13.65 | IC18.10 118.43,13.65 | 134.94,13.65 IC23.10 | 118.43,13.65 134.94,13.65 | 151.45,13.65 IC24.10 | 134.94,13.65 151.45,13.65 | PWR1.K 162.88,13.65 151.45,13.65 | C6.2 108.9,66.36 123.51,66.36 | C20.2 123.51,66.36 | 140.02,66.36 C10.2 | 123.51,66.36 140.02,66.36 | C17.2 156.53,66.36 140.02,66.36 | JP5.28 JP5.27 158.75,40.64 C9.2 156.53,38.42 140.02,38.42 | 134.94,47.31 IC20.7 | 134.94,47.31 120.33,47.31 IC14.7 116.84,48.26 C23.2 | 140.02,38.42 C8.2 | 140.02,38.42 125.41,38.42 C22.2 | IC19.7 151.45,47.31 134.94,47.31
H/L-SWAP
  Top 0.152: IC6.1 IC6.2 79.69,33.97 79.69,53.66 IC5.13
  Bottom 0.152: X2.A30 1.27,87.63 1.27,52.07 5.4,52.07 6.35,51.12 6.35,49.53 33.02,49.53 33.97,48.58 46.35,48.58 47.94,50.16 68.26,50.16 71.12,53.02 77.15,53.02 IC5.13
N$1  (via drill 0.33)
  Top 0.152: v100.65,60.33 100.65,96.84 IC15.1
  Bottom 0.152: IC13.3 100.97,60.33 v100.65,60.33
N$2
  Bottom 0.152: IC11.12 51.75,109.54 26.04,109.54 25.72,109.22 19.05,109.22 JP3.1
N$3
  Bottom 0.152: IC11.11 54.29,106.36 21.91,106.36 JP3.3
N$4  (via drill 0.33)
  Top 0.152: JP3.5 v26.35,104.46
  Bottom 0.152: IC11.10 54.93,104.46 v26.35,104.46
N$5  (via drill 0.33)
  Top 0.152: v27.3,110.81 25.4,108.9 JP3.7
  Bottom 0.152: IC11.9 58.1,110.81 v27.3,110.81
N$6
  Bottom 0.152: IC12.12 51.12,97.47 15.56,97.47 JP4.1
N$7
  Bottom 0.152: IC12.11 53.02,98.11 17.46,98.11 JP4.3
N$8
  Bottom 0.152: IC12.10 54.93,98.74 19.37,98.74 JP4.5
N$9  (via drill 0.33)
  Top 0.152: v13.97,93.66 12.7,94.93 JP4.7
  Bottom 0.152: IC12.9 59.37,93.66 v13.97,93.66
N$11
  Bottom 0.152: IC2.12 51.75,15.56 25.4,15.56 16.51,6.67 16.51,3.81 JP2.1
N$12  (via drill 0.33)
  Top 0.152: IC17.1 104.46,37.15 v104.46,42.23
  Bottom 0.152: IC13.8 v104.46,42.23
N$13
  Top 0.152: PWR1.A 173.99,5.08 R2.1
N$14
  Top 0.152: IC1.13 77.79,67.63 77.79,39.05 62.55,23.81 62.55,5.4 59.05,1.91 3.81,1.91 3.81,5.08 JP1.2 JP1.4 JP1.6 JP1.8
N$15  (via drill 0.33)
  Top 0.152: v149.54,59.37 146.37,62.55 146.37,95.57 143.83,98.11 135.89,98.11 IC21.1
  Bottom 0.152: IC19.3 151.45,59.37 v149.54,59.37
N$17  (via drill 0.33)
  Top 0.152: IC23.1 136.84,36.51 v136.84,46.04
  Bottom 0.152: v136.84,46.04 137.48,46.67 157.16,46.67 158.75,48.26 IC19.8
N$19  (via drill 0.33)
  Top 0.152: v108.9,34.61 108.9,54.29 IC13.11
  Bottom 0.152: IC18.1 118.43,34.61 v108.9,34.61
N$21  (via drill 0.33)
  Top 0.152: v157.16,37.78 158.43,39.05 158.43,53.98 160.02,55.56 IC19.11
  Bottom 0.152: IC24.1 154.62,37.78 v157.16,37.78
N$23  (via drill 0.33)
  Top 0.152: v162.24,49.85 162.24,86.04 160.34,87.95 155.89,87.95 155.89,95.57 IC22.1
  Bottom 0.152: IC19.6 153.35,49.85 v162.24,49.85
N$25
  Top 0.152: IC13.6 107.63,55.56 107.63,65.72 108.9,66.99 108.9,96.84 110.17,98.11 119.38,98.11 IC16.1
N$27
  Top 0.152: IC2.4 46.99,2.54 5.08,2.54 JP1.1
N$28
  Bottom 0.152: IC2.5 54.93,7.94 56.2,7.94 56.83,7.3 56.83,5.4 53.34,1.91 9.53,1.91 JP1.3
N$29
  Bottom 0.152: IC2.6 52.07,2.54 11.43,2.54 JP1.5
N$30
  Bottom 0.152: IC2.7 53.34,1.27 8.57,1.27 6.35,3.49 6.35,5.08 11.43,5.08 JP1.7
N$31
  Top 0.152: JP2.2 JP2.4 JP2.6 JP2.8 42.23,6.35 42.23,11.11 44.13,13.02 44.13,14.92 41.59,17.46 38.1,17.46 IC3.1 37.15,20 37.15,46.04 IC4.1
N$32  (via drill 0.33)
  Top 0.152: v63.18,9.21 80.33,26.35 80.33,35.24 85.41,40.32 85.41,67.63 IC1.10
  Bottom 0.152: IC2.1 46.04,9.21 v63.18,9.21
N$33  (via drill 0.33)
  Top 0.152: IC3.11 61.91,27.62 61.91,53.66 IC4.11 | IC1.12 79.69,66.99 v79.69,59.05
  Bottom 0.152: v79.69,59.05 77.47,56.83 63.18,56.83 IC4.11
N$34  (via drill 0.33)
  Top 0.152: v51.75,9.84 IC2.11
  Bottom 0.152: v51.75,9.84 30.48,9.84 25.72,5.08 21.59,5.08 JP2.3
N$35
  Top 0.152: IC2.10 56.83,15.56 49.21,15.56 49.21,11.75 46.67,9.21 46.67,5.4 46.04,4.76 26.04,4.76 25.72,5.08 22.86,5.08 JP2.5
N$36
  Top 0.152: IC2.9 61.91,13.02 61.91,5.4 61.28,4.76 54.29,4.76 54.29,7.3 53.66,7.94 49.21,7.94 49.21,5.4 47.62,3.81 JP2.7
N$37  (via drill 0.33)
  Top 0.152: v63.18,42.55 68.58,47.94 v68.58,52.07
  Bottom 0.152: IC9.19 42.55,42.55 v63.18,42.55 | v68.58,52.07 72.71,56.2 82.23,56.2 IC5.11
N$38  (via drill 0.33)
  Top 0.152: IC7.19 42.23,85.41 42.23,88.58 42.86,89.22 47.31,89.22 47.31,79.06 49.85,76.52 v49.85,67.63 | v90.49,64.45 92.39,62.55 92.39,55.56 IC5.8
  Bottom 0.152: v49.85,67.63 73.03,67.63 76.2,64.45 v90.49,64.45
N$39  (via drill 0.33)
  Top 0.152: IC8.19 40.96,69.53 v40.96,65.72 | v62.23,65.72 67.63,60.33 v67.63,48.9
  Bottom 0.152: v62.23,65.72 v40.96,65.72 | v67.63,48.9 71.12,45.4 87.31,45.4 IC5.6
N$40
  Top 0.152: IC5.4 IC5.3 IC5.12 | IC5.5 IC5.10
  Bottom 0.152: IC5.4 IC5.5
N$41
  Top 0.152: IC6.3 87.95,39.69 87.95,53.66 IC5.9
N$42  (via drill 0.33)
  Top 0.152: IC6.6 v67.63,11.75
  Bottom 0.152: IC2.15 47.94,11.75 v67.63,11.75
REG-FUNC  (via drill 0.33)
  Top 0.152: X2.B7 8.89,31.75 11.43,31.75 v11.43,29.84 | v68.58,28.89 78.74,39.05 IC6.13
  Bottom 0.152: IC6.12 IC6.13 | v11.43,29.84 11.75,29.53 41.27,29.53 41.91,28.89 v68.58,28.89
VCC  (via drill 0.33)
  Top 0.152: 40.01,9.53 43.18,12.7 IC2.16 | 40.01,9.53 C15.1 | X2.A2 X2.B2 X2.C2 | 35.24,34.61 35.24,22.54 C24.1 34.29,15.24 40.01,9.53 | C19.1 35.24,34.61 | 35.24,34.61 35.24,48.58 C21.1 35.24,50.48 35.24,65.72 | IC3.20 39.05,27.62 39.05,39.69 | IC9.20 39.05,39.69 | 39.05,39.69 39.05,53.66 IC4.20 36.51,56.2 36.51,66.99 | 36.51,66.99 38.1,68.58 IC8.20 34.29,73.66 C7.1 38.1,82.55 IC7.20 39.37,85.09 C4.1 42.23,93.03 | 36.51,66.99 35.24,65.72 | 35.24,65.72 C18.1 | IC11.16 43.18,106.68 C12.1 42.23,100.01 42.23,93.03 | X2.A31 X2.B31 X2.C31 | 42.23,93.03 43.18,93.98 IC12.16 | C5.1 158.75,99.06 IC22.20 | C14.1 125.73,99.06 IC16.20 127,102.87 C16.1 | 121.92,63.5 IC14.14 | C20.1 121.92,63.5 | RN1.1 RN2.1 73.34,76.52 73.34,65.72 72.39,64.77 C1.1 73.34,62.55 73.34,48.58 | 75.25,38.42 76.2,39.37 IC6.14 | 75.25,38.42 73.98,37.15 | 73.98,37.15 C3.1 | 73.34,48.58 73.98,47.94 73.98,37.15 | 73.34,48.58 C2.1 | 75.25,53.66 IC5.14 | 75.25,38.42 75.25,53.66 | IC1.14 75.25,67.63 75.25,53.66 | IC24.20 154.94,35.56 C9.1 | R2.2 170.81,22.23 v170.81,33.66 | C22.1 121.92,63.5 | C6.1 C13.1
  Bottom 0.152: X2.C2 11.43,21.59 C24.1 | X2.C31 11.43,95.25 IC12.16 | C13.1 105.73,102.55 107,102.55 IC15.20 111.44,100.01 127.95,100.01 | 142.56,100.01 IC21.20 | 127.95,100.01 142.56,100.01 | IC16.20 127.95,100.01 | IC22.20 159.07,100.01 142.56,100.01 | IC13.14 111.44,64.45 126.05,64.45 | IC14.14 126.05,64.45 | 142.56,64.45 IC20.14 | 126.05,64.45 142.56,64.45 | IC19.14 159.38,64.14 153.67,64.14 153.35,64.45 142.56,64.45 | C6.1 106.36,68.26 120.97,68.26 | C20.1 120.97,68.26 | 137.48,68.26 C10.1 | 120.97,68.26 137.48,68.26 | C17.1 154.62,67.63 141.92,67.63 141.29,68.26 137.48,68.26 | v170.81,33.66 168.91,35.56 IC24.20 | 105.73,39.05 109.22,35.56 IC17.20 114.3,39.37 C22.1 122.56,38.73 | 124.78,36.51 125.73,35.56 IC18.20 | 124.78,36.51 122.56,38.73 | 137.48,40.32 C8.1 | 137.48,40.32 124.14,40.32 122.56,38.73 | IC23.20 142.56,36.51 124.78,36.51 | C9.1 153.99,40.32 137.48,40.32 | IC6.14 77.79,39.05 105.73,39.05 | 105.73,39.05 C23.1 | C3.1 C19.1

## Text on the board
tNames: YACC1 REGISTER BOARD 1.1 | 1 | 2 | 3 | 4 | 1 | 2 | 3 | 4 | REG 0 | REG 2 | 1 | REG 1 | REG 3 | 1 | 2 | 3 | 4 | 1 | 2 | 3 | 4 | onepagecomputer.com